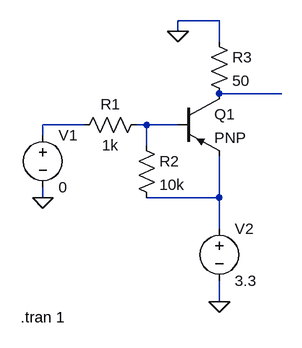
[diagram p0: schematic npn.asc]
npn.asc, the LTspice schematic file:
Version 4
SHEET 1 880 680
WIRE 320 -48 256 -48
WIRE 256 -32 256 -48
WIRE 320 -16 320 -48
WIRE 416 64 320 64
WIRE 112 112 48 112
WIRE 208 112 192 112
WIRE 256 112 208 112
WIRE 48 128 48 112
WIRE 208 144 208 112
WIRE 48 224 48 208
WIRE 320 224 320 160
WIRE 320 224 208 224
WIRE 320 272 320 224
WIRE 320 384 320 352
FLAG 320 384 0
FLAG 256 -32 0
FLAG 48 224 0
SYMBOL voltage 48 112 R0
WINDOW 123 0 0 Left 0
WINDOW 39 0 0 Left 0
SYMATTR InstName V1
SYMATTR Value 0
SYMBOL res 208 96 R90
WINDOW 0 0 56 VBottom 2
WINDOW 3 32 56 VTop 2
SYMATTR InstName R1
SYMATTR Value 1k
SYMBOL pnp 256 64 R0
SYMATTR InstName Q1
SYMBOL res 192 128 R0
SYMATTR InstName R2
SYMATTR Value 10k
SYMBOL voltage 320 256 R0
WINDOW 123 0 0 Left 0
WINDOW 39 0 0 Left 0
SYMATTR InstName V2
SYMATTR Value 3.3
SYMBOL res 304 -32 R0
SYMATTR InstName R3
SYMATTR Value 50
TEXT 14 408 Left 2 !.tran 1

The netlist it stands for:
* npn.asc
V1 N002 0 0
R1 N003 N002 1k
Q1 N001 N003 N004 0 PNP
R2 N003 N004 10k
V2 N004 0 3.3
R3 0 N001 50
.model NPN NPN
.model PNP PNP
.lib standard.bjt
.tran 1
.backanno
.end